# Altium schematic sheet Customized Battery Management System - Load Sharing System.SchDoc
size A4; SheetNumber: 1; SheetTotal: 5
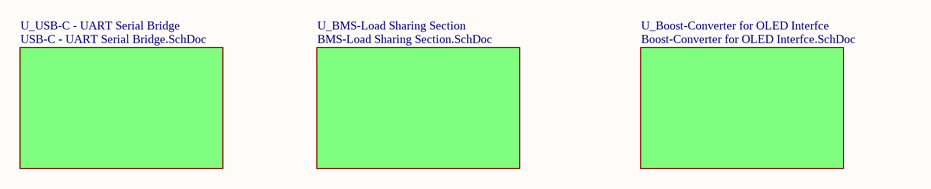
[diagram p0: Customized Battery Management System - Load Sharing System.SchDoc]

## Sub-sheets
U_BMS-Load Sharing Section = BMS-Load Sharing Section.SchDoc: no entries
U_Boost-Converter for OLED Interfce = Boost-Converter for OLED Interfce.SchDoc: no entries
U_USB-C - UART Serial Bridge = USB-C - UART Serial Bridge.SchDoc: no entries